# Altium schematic sheet power.SchDoc
size A4
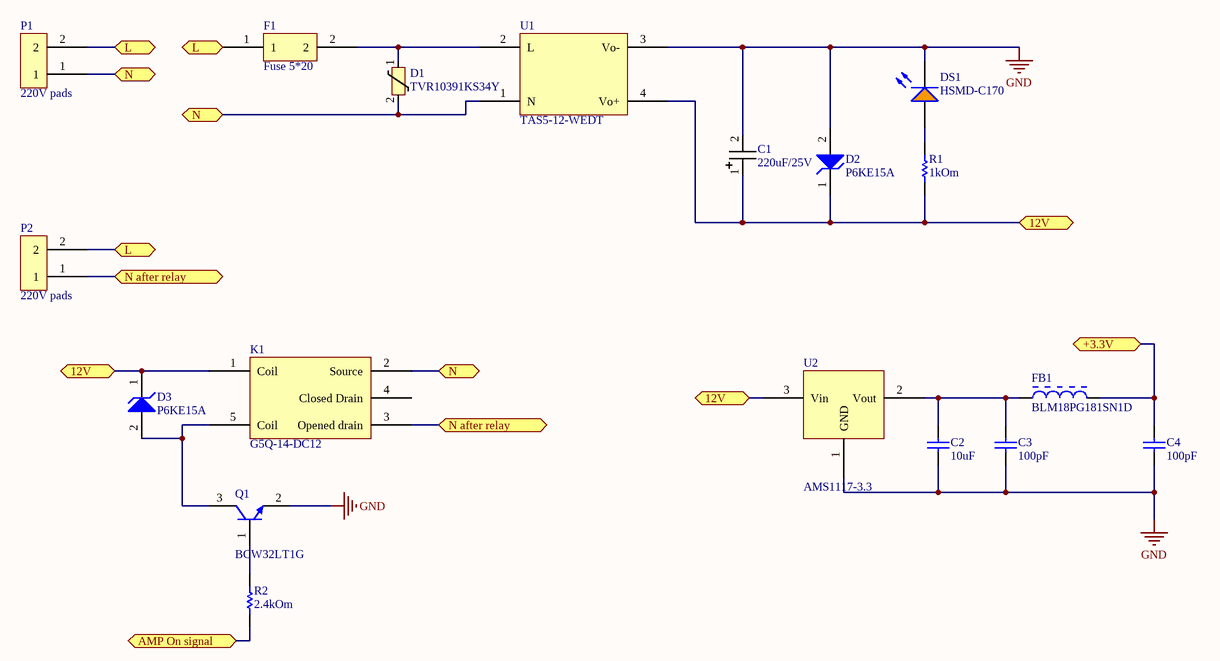
[diagram p0: power.SchDoc]

## Parts
C1  220uF/25V  [Capacitor 7*8]
C2  10uF  [CAPC1608X90X35ML10T15]
C3  100pF  [CAPC1608X90X35ML10T15]
C4  100pF  [CAPC1608X90X35ML10T15]
D1  TVR10391KS34Y  [TVR10391KS34Y]
D2  P6KE15A  [ONSC-SURMETIC40-2-017AA-01]
D3  P6KE15A  [ONSC-SURMETIC40-2-017AA-01]
DS1  HSMD-C170  [AVAG-HSMX-C170_V]
F1  Fuse 5*20  [Fuse 5*20]
FB1  BLM18PG181SN1D  [MURA-BLM18PG_KG-CHIP-2_V2]
K1  G5Q-14-DC12  [G5Q-14-DC12]
P1  220V pads  [220V pads]
P2  220V pads  [220V pads]
Q1  BCW32LT1G  [ONSC-SOT-23-3-318-08_V]
R1  1kOm  [RESC1608X55X30ML20T10]
R2  2.4kOm  [RESC1608X55X30ML20T10]
U1  TAS5-12-WEDT  [TAS5-12-WEDT]
U2  AMS1117-3.3  [AMS1117]

## Ports
12V (bidir), +3.3V (bidir), AMP On signal (bidir), L (bidir), N (bidir), N after relay (bidir)

## Nets
GND: C1.2 C2.1 C3.1 C4.1 D2.2(A) DS1.2(K) Q1.2(E) U1.3(Vo-) U2.1(GND)
12V: C1.1 D2.1(K) D3.1(K) K1.1(Coil) R1.1 U1.4(Vo+) U2.3(Vin) ; port 12V
+3.3V: C4.2 FB1.2 ; port +3.3V
AMP On signal: R2.1 ; port AMP On signal
L: F1.1 P1.2 P2.2 ; port L
N: D1.2 K1.2(Source) P1.1 U1.1(N) ; port N
N after relay: K1.3(Opened_drain) P2.1 ; port N after relay
NetC2_2: C2.2 C3.2 FB1.1 U2.2(Vout)
NetD1_1: D1.1 F1.2 U1.2(L)
NetD3_2: D3.2(A) K1.5(Coil) Q1.3(C)
NetDS1_1: DS1.1(A) R1.2
NetQ1_1: Q1.1(B) R2.2

Not connected (* = marked no-connect by the designer): K1 4(Closed_Drain)

## Library data of the parts
C1 = Capacitor 7*8
C2-C4 = CMP-2006-02335-1: Manufacturer: Murata; Part Number: GCM1885C2A101JA16D
D2 D3 = CMP-1061-00710-1: 600 W Peak Power Transient Voltage Suppressor, 2-Pin Surmetic(TM) 40, Pb-Free, Bulk Box; Manufacturer: On Semiconductor; PartNumber: P6KE15AG; PPK Max (W): 600; Direction: Unidirectional; V(BR) Typ (V): 15.05; IR Max (uA): 5; Packing: Bulk Box; ComponentLink2URL: http://www.onsemi.com/pub_link/Collateral/P6KE6.8A-D.PDF; ComponentLink1URL: http://www.onsemi.com/; DatasheetVersion: Rev. 10; ComponentLink2Description: Datasheet; ComponentLink3Description: Package Specification; Mounting Technology: Through Hole; PackageReference: SURMETIC40-2-017AA-01; ComponentLink1Description: Manufacturer URL; ComponentLink3URL: http://www.onsemi.cn/pub_link/Collateral/017AA.PDF; PackageVersion: Rev. O, 09/2005; RoHS: Pb-Free; PackageDescription: 2-Pin, Axial Lead, Diameter 3.49 mm
DS1 = CMP-2000-06421-1: LED Uni-Color Orange, 52 mW, 20 mA, -40 to 85 degC, 2-Pin SMD, RoHS, Tape and Reel; Manufacturer: Avago; Forward Current If Max: 20mA; External Length / Height: 2mm; Luminous Intensity: 8mcd; Lens Shape: Rectangular; Bulb Size: 1.25mmx1.4mm; External Width: 1.25mm; Wavelength Typ: 605nm; Dominant Wavelength: 604nm; PIV Max: 5V; Opto Mounting Orientation: Top; Viewing Angle: 170°; LED Type: Standard; Forward Voltage: 2.2V; SVHC: NoSVHC(19-Dec-2012); No. of Pins: 2; External Depth: 0.8mm; Power Dissipation Pd: 52mW; Storage Temperature Max: 85°C; Package Description: 2-Pin Surface Mount Device, Body 2 x 1.25 mm, Height 0.8 mm; MSL: MSL2A-4weeks; Operating Temperature Range: -30°Cto+85°C; Datasheet URL: http://docs.avagotech.com/docs/AV02-0551EN; Manufacturer URL: http://www.avagotech.com/; Operating Temperature Min: -30°C; Light Area Height: 1.25mm; Mounting Technology: SurfaceMount; Storage Temperature Min: -40°C; LED Mounting: SMD; Peak Wavelength: 605nm; Package / Case: SMD; Peak Forward Current: 20mA; Forward Voltage VF Max: 2.2V; Mounting Type: SMD; LED Colour: Orange; Forward Current If: 20mA; Operating Temperature Max: 85°C; Voltage Vf Typ: 2.2V; Package Reference: HSMX-C170; Datasheet Version: 03/2012; Opto Case Style: SMD; Luminous Intensity Typ: 8mcd
FB1 = CMP-0686-00566-2: Chip Ferrite Bead for Power Lines, 180 Ohm, 1500 mA, -55 to 125 degC, 1.6 x 0.8 x 0.95 mm SMD, Tape and Reel; Manufacturer: Murata; Impedance (at 100 MHz): 180 Ohm +/- 25%; Rated Current: 1500 mA; DC Resistance: 0.09 Ohm Max.; ComponentLink3Description: Package Specification; PackageDescription: 2-Pin Chip, Body 1.6 x 0.8 mm; Mounting Technology: Surface Mount; ComponentLink1Description: Manufacturer URL; Operating Temperature Range: -55 to 125 degC; Packing: Tape and Reel; DatasheetVersion: 08/2013; ComponentLink3URL: http://www.murata.com/products/catalog/pdf/c31e.pdf; ComponentLink2Description: Datasheet; PartNumber: BLM18PG181SN1D; ComponentLink1URL: http://www.murata.com/; ComponentLink2URL: http://www.murata.com/products/catalog/pdf/c31e.pdf; PackageReference: BLM18_H950-2
Q1 = CMP-1048-00823-1: General Purpose Transistor, NPN Silicon, 3-Pin SOT-23, Pb-Free, Tape and Reel; Manufacturer: On Semiconductor; IC Continuous (A): 0.1; PackageReference: SOT-23-3-318-08; Polarity: NPN; Mounting Technology: Surface Mount; ComponentLink2URL: http://www.onsemi.com/pub_link/Collateral/BCW32LT1-D.PDF; RoHS: TRUE; PackageVersion: Rev. AP, 11/2009; Packing: Tape and Reel; ComponentLink3Description: Package Specification; PartNumber: BCW32LT1G; ComponentLink1Description: Manufacturer URL; PackageDescription: 3-Pin Small Outline Transistor, Body 2.92 x 1.3 mm, Pitch 0.95 mm; ComponentLink3URL: http://www.onsemi.cn/pub_link/Collateral/318-08.PDF; ComponentLink1URL: http://www.onsemi.com/; DatasheetVersion: Rev. 2; ComponentLink2Description: Datasheet
R1 R2 = CMP-2000-01555-1: Part Number: RK73H1JTTD5101F; Manufacturer: KOA Speer
D1 = TVR10391KS34Y: ComponentLink1Description: https://lcsc.com/product-detail/Varistors_TKS-TVR10391KS34Y_C2760960.html; ComponentLink1URL: *
F1 = Fuse 5*20: ComponentLink1Description: https://lcsc.com/product-detail/span-style-background-color-ff0-Fuse-span-Holders_Xucheng-Elec-C3130_C3130.html; ComponentLink1URL: *
K1 = G5Q-14-DC12: ComponentLink1Description: https://lcsc.com/product-detail/Relays_Omron-Electronics-G5Q-14-DC12_C225715.html; ComponentLink1URL: *
U1 = TAS5-12-WEDT: ComponentLink1Description: https://lcsc.com/product-detail/Power-Modules_TDPOWER-TAS5-12-WEDT_C2687652.html; ComponentLink1URL: *
U2 = AMS1117-3.3: ComponentLink1Description: New link; ComponentLink1URL: https://lcsc.com/product-detail/Low-Dropout-Regulators-LDO_Slkor-SLKORMICRO-Elec-AMS1117-3-3_C426566.html; ComponentLink2Description: New link; ComponentLink2URL: https://lcsc.com/product-detail/Low-Dropout-Regulators-LDO_PUOLOP-AMS1117-3-3_C351784.html